# EAGLE design GP1A57 (EAGLE 6.2)
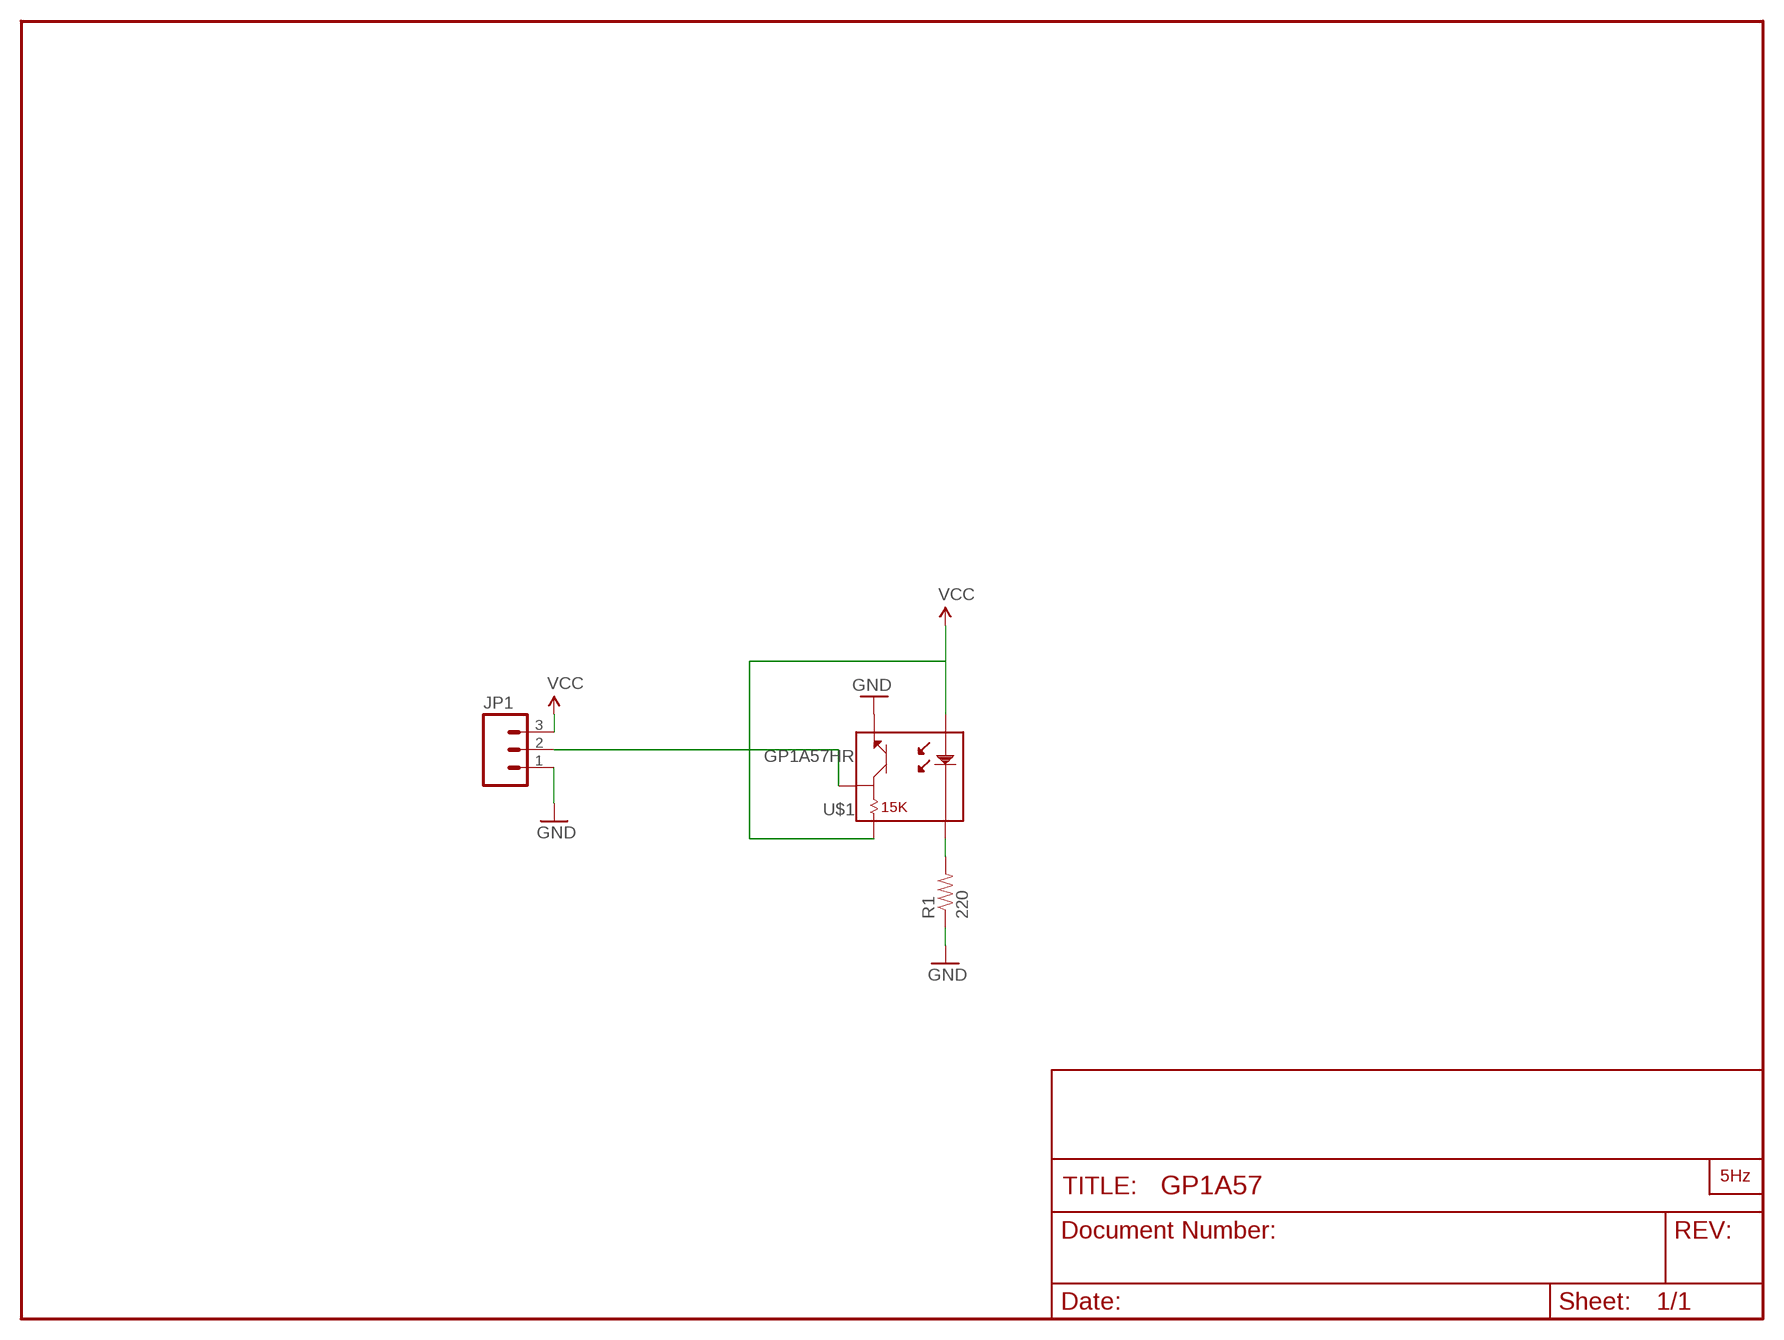
[diagram p0: schematic, sheet 1]

## Parts
JP1  M03PTH  [1X03]
R1  220  RESISTORPTH-1/4W  [AXIAL-0.4]
U$1  GP1A57HR  [GP1A57HR]
U$2  LOGO2_SILKL10MM  [LARGO2_10MM]

## Nets
GND: JP1.1 R1.P$1 U$1.5
N$1: R1.P$2 U$1.2
N$3: JP1.2 U$1.4
VCC: JP1.3 U$1.1 U$1.3

## Library data of the parts
JP1 = SparkFun:M03: Header 3 Standard 3-pin 0.1" header. Use with straight break away headers (SKU : PRT-00116), right angle break away headers (PRT-00553), swiss pins (PRT-00743), machine pins (PRT-00117), and female headers (PRT-00115). Molex polarized connector foot print use with SKU : PRT-08232 with associated crimp pins and housings.
R1 = SparkFun:RESISTOR: Resistor Basic schematic elements and footprints for 0603, 1206, and PTH resistors.
U$1 = SparkFun:GP1A57HR
U$2 = LOGO:LOGO2_SILK: PRINCIPAL

## Board
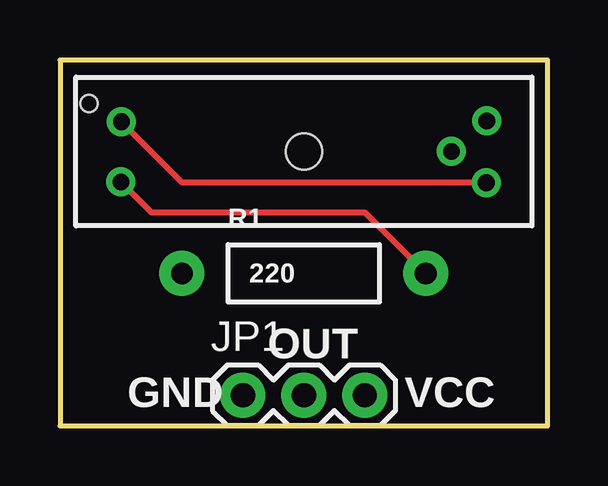
[diagram p1: board, top side]
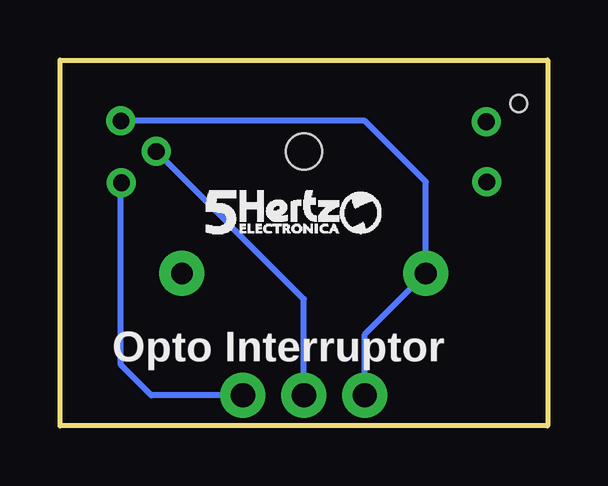
[diagram p2: board, bottom side, seen from below]

Size 20.32 x 15.24 mm. Coordinates in mm from the lower left corner, seen from the top.
Outline: 0,0 20.32,0 20.32,15.24 0,15.24 0,0
Copper layers (1*16): Top 0.035mm / dielectric 1.5mm / Bottom 0.035mm
Design rules: minimum track width 10mil, minimum drill 24mil, track to track 8mil, track to pad 8mil, pad to pad 8mil, via to via 8mil, smd to smd 8mil, copper to edge 40mil, drill to drill 8mil, minimum pad ring 10mil, minimum via ring 8mil, stop-mask expansion 4mil, vias tented up to drill 0mil, thermal gap 10mil

### Footprints (pad centres in the part's own frame; a part is rotated, then mirrored left to right if it is on the bottom)
1X03 = drill 1.016 pad 1.88: 1 0,0; 2 2.54,0; 3 5.08,0
AXIAL-0.4 = drill 0.9 pad 1.88: P$1 -5.08,0; P$2 5.08,0
GP1A57HR = drill 0.7: 1 -7.6,1.24; 2 -7.62,-1.27; 3 7.6,-1.3; 4 6.15,0; 5 7.62,1.27 | hole 1.5: 0,0 | hole 0.7: -8.95,2

### Placement (x,y rotation side)
JP1  7.62,1.27 0 top
R1  10.16,6.35 0 top
U$1  10.16,11.43 0 top
U$2  14.22,8 0 bottom

### Tracks (layer width: path | path; a pad name or v marks a point on that pad's centre or on a via)
GND
  Bottom 0.254: JP1.1 7.62,3.81 R1.P$1 5.08,10.16 7.62,12.7 U$1.5
N$1
  Top 0.254: U$1.2 3.81,8.89 12.7,8.89 R1.P$2
N$3
  Bottom 0.254: JP1.2 10.16,5.28 U$1.4
VCC
  Top 0.254: U$1.3 5.1,10.13 U$1.1
  Bottom 0.254: JP1.3 16.51,1.27 17.78,2.54 17.78,10.11 U$1.3

### Text on the board
tPlace: OUT | GND | VCC
bPlace: Opto Interruptor